# Altium schematic sheet OpenPLCv0.2.0_SDCard.SchDoc
size 420 x 297 mm; PageSetup: Record=PageOptions|CenterHorizontal=True|CenterVertical=True|PrintScale=1.01|XCorrection=1.00|YCorrection=1.00|PrintKind=1|BorderSize=5000000|LeftOffset=0|BottomOffset=0|Orientation=2|PaperLength=1000|PaperWidth=1000|Scale=100|PaperSource=7|PrintQuality=-4|MediaType=1|DitherType=10|PaperKind=A3|PrintScaleMode=1; DocumentNumber: 17; SheetNumber: 17; SheetTotal: 22; SheetTitle: SD Card Slot
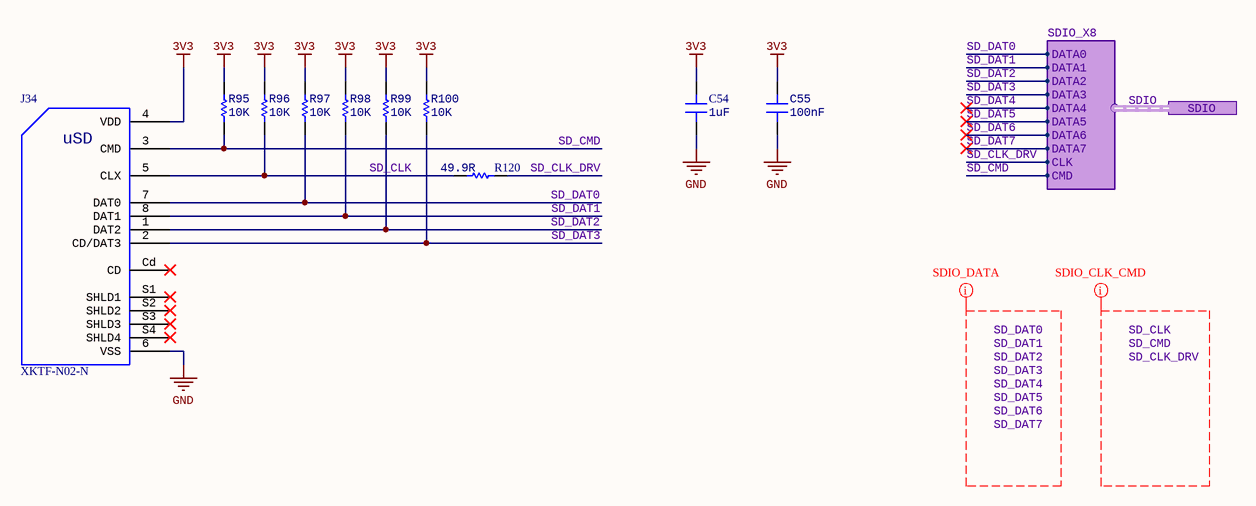
[diagram p0: OpenPLCv0.2.0_SDCard.SchDoc]

## Parts
C54  Capacitance: 1uF  [SMD_CAP_0603(0201)_N]  (hidden comment: CC0603KRX5R9BB105)
C55  Capacitance: 100nF  [SMD_CAP_0402(1005)_N]  (hidden comment: CC0402KRX5R6BB104)
J34  XKTF-N02-N  [XKTF-N02-N]
R95  Resistance: 10K  [SMD_RES_0402(1005)_N]  (hidden comment: RC0402FR-0710KL)
R96  Resistance: 10K  [SMD_RES_0402(1005)_N]  (hidden comment: RC0402FR-0710KL)
R97  Resistance: 10K  [SMD_RES_0402(1005)_N]  (hidden comment: RC0402FR-0710KL)
R98  Resistance: 10K  [SMD_RES_0402(1005)_N]  (hidden comment: RC0402FR-0710KL)
R99  Resistance: 10K  [SMD_RES_0402(1005)_N]  (hidden comment: RC0402FR-0710KL)
R100  Resistance: 10K  [SMD_RES_0402(1005)_N]  (hidden comment: RC0402FR-0710KL)
R120  Resistance: 49.9R  [SMD_RES_0402(1005)_N]  (hidden comment: RC0402FR-0749R9L)

## Ports
SDIO (harness SDIO_X8)

## Harnesses
SDIO_X8: DATA1, DATA0, DATA2, DATA3, DATA4, DATA5, DATA6, CMD, CLK, DATA7

## Nets
3V3: C54.2 C55.2 J34.4(VDD) R95.2 R96.2 R97.2 R98.2 R99.2 R100.2
GND: C54.1 C55.1 J34.6(VSS)
SD_CLK: J34.5(CLX) R96.1 R120.1
SD_CLK_DRV: R120.2 ; port SDIO.CLK
SD_CMD: J34.3(CMD) R95.1 ; port SDIO.CMD
SD_DAT0: J34.7(DAT0) R97.1 ; port SDIO.DATA0
SD_DAT1: J34.8(DAT1) R98.1 ; port SDIO.DATA1
SD_DAT2: J34.1(DAT2) R99.1 ; port SDIO.DATA2
SD_DAT3: J34.2(CD/DAT3) R100.1 ; port SDIO.DATA3
SD_DAT4: port SDIO.DATA4
SD_DAT5: port SDIO.DATA5
SD_DAT6: port SDIO.DATA6
SD_DAT7: port SDIO.DATA7

Not connected (* = marked no-connect by the designer): J34 Cd(CD)* S1(SHLD1)* S2(SHLD2)* S3(SHLD3)* S4(SHLD4)*

## Buses and harness runs
harness SDIO = port SDIO

## Layout directives
net class SDIO_DATA: SD_DAT0, SD_DAT1, SD_DAT2, SD_DAT3, SD_DAT4, SD_DAT5, SD_DAT6, SD_DAT7
net class SDIO_CLK_CMD: SD_CLK, SD_CLK_DRV, SD_CMD

## Notes on the sheet
- Labels drawn without touching a wire or pin: SD_CLK, SD_CLK_DRV, SD_CMD, SD_DAT0, SD_DAT1, SD_DAT2, SD_DAT3, SD_DAT4, SD_DAT5, SD_DAT6, SD_DAT7
- FILE NAME
- PROJECT
- TITLE
- REV
- AUTHOR
- SIZE
- SHEET
- DATE
- OF
- A3
- (in symbol XKTF-N02-N) uSD

## Library data of the parts
C54 = 1uF 0603 50V 10%: 1uF ±10% 50V X5R 0603 Multilayer Ceramic Capacitors MLCC - SMD/SMT RoHS; Package: 0603; Tolerance: 10%; Voltage Rating: 50V
C55 = 100nF 0402 10V 10%: 100nF ±10% 10V X5R 0402 Multilayer Ceramic Capacitors MLCC - SMD/SMT RoHS; Package: 0402; Tolerance: 10%; Voltage Rating: 10V
J34 = XKTF-N02-N: XKB Enterprise XKTF-N02-N / SMD Card Sockets Connectors RoHS
R95-R100 = 10K 0402 1% 1/16W: 10kΩ ±1% 1/16W ±100ppm/℃ 0402 Chip Resistor - Surface Mount RoHS; Package: 0402; Tolerance: 1%; Power Rating: 1/16W
R120 = 49R9 0402 1% 1/16W: 49.9Ω ±1% 1/16W ±100ppm/℃ 0402 Chip Resistor - Surface Mount RoHS; Package: 0402; Tolerance: 1%; Power Rating: 1/16W